# Altium schematic sheet Sheet1.SchDoc
size A; SheetNumber: 1; SheetTotal: 1
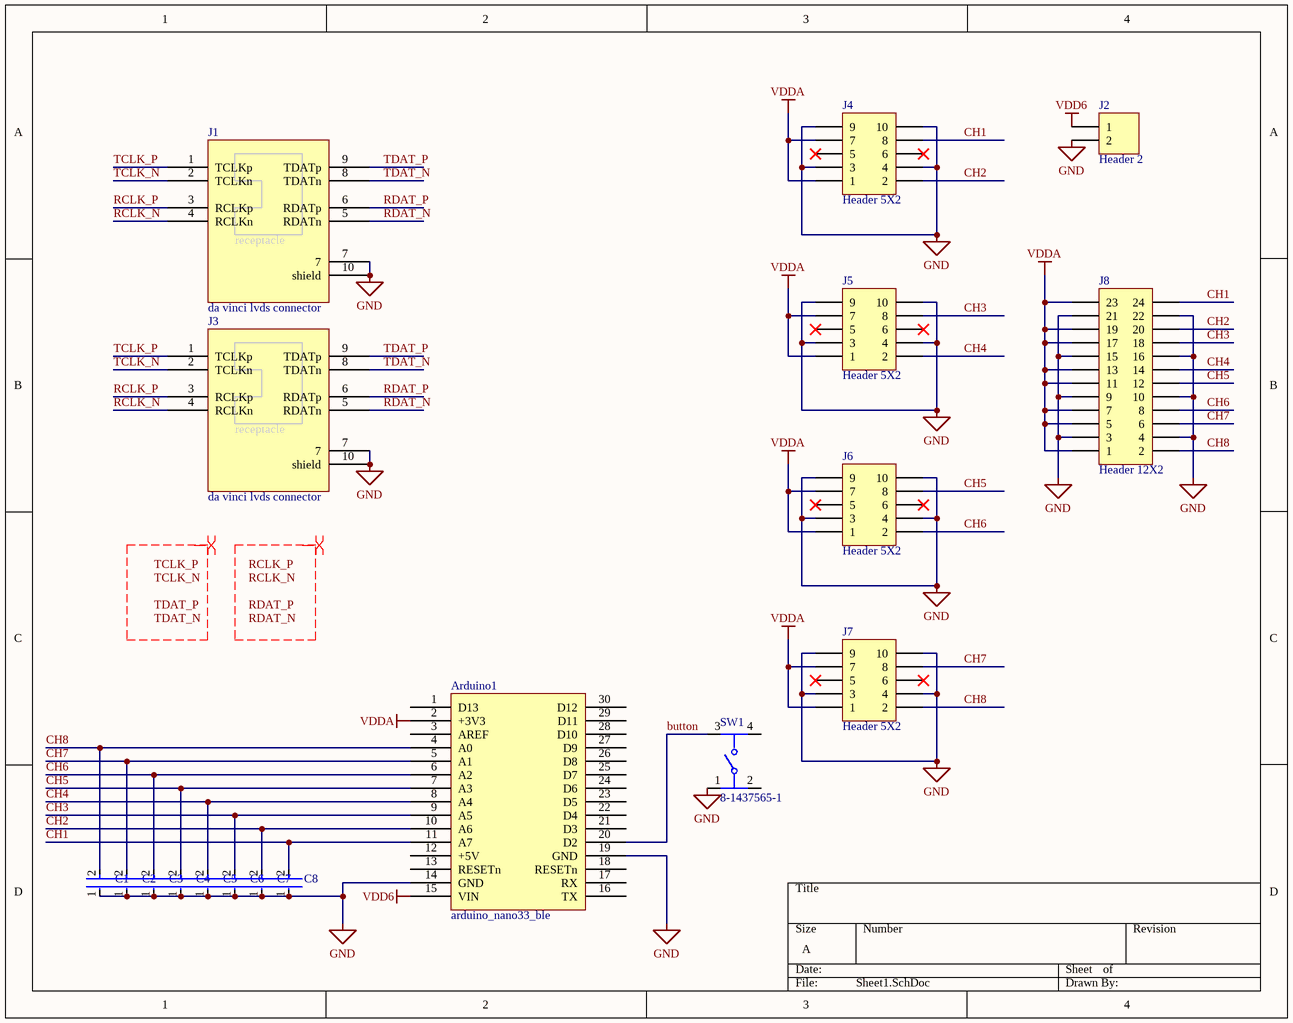
[diagram p0: Sheet1.SchDoc]

## Parts
Arduino1  arduino_nano33_ble  [arduino_nano33_ble]
C1  GRM155R71C104KA88D  [FP-GRM15-MFG]  (value not drawn)
C2  GRM155R71C104KA88D  [FP-GRM15-MFG]  (value not drawn)
C3  GRM155R71C104KA88D  [FP-GRM15-MFG]  (value not drawn)
C4  GRM155R71C104KA88D  [FP-GRM15-MFG]  (value not drawn)
C5  GRM155R71C104KA88D  [FP-GRM15-MFG]  (value not drawn)
C6  GRM155R71C104KA88D  [FP-GRM15-MFG]  (value not drawn)
C7  GRM155R71C104KA88D  [FP-GRM15-MFG]  (value not drawn)
C8  GRM155R71C104KA88D  [FP-GRM15-MFG]  (value not drawn)
J1  da vinci lvds connector  [1394b]
J2  Header 2  [jst_2mm]
J3  da vinci lvds connector  [1394b]
J4  Header 5X2  [jst_pad10]
J5  Header 5X2  [jst_pad10]
J6  Header 5X2  [jst_pad10]
J7  Header 5X2  [jst_pad10]
J8  Header 12X2  [jst_pad24]
SW1  8-1437565-1  [FP-8-1437565-1-MFG]

## Nets
GND: Arduino1.14(GND) Arduino1.19(GND) C1.1 C2.1 C3.1 C4.1 C5.1 C6.1 C7.1 C8.1 J1.7 J1.10(shield) J2.2 J3.7 J3.10(shield) J4.3 J4.4 J4.9 J4.10 J5.3 J5.4 J5.9 J5.10 J6.3 J6.4 J6.9 J6.10 J7.3 J7.4 J7.9 J7.10 J8.3 J8.4 J8.9 J8.10 J8.15 J8.16 J8.21 J8.22 SW1.1
VDD6: Arduino1.15(VIN) J2.1
VDDA: Arduino1.2(+3V3) J4.1 J4.7 J5.1 J5.7 J6.1 J6.7 J7.1 J7.7 J8.1 J8.5 J8.7 J8.11 J8.13 J8.17 J8.19 J8.23
button: Arduino1.20(D2) SW1.3
CH1: Arduino1.11(A7) C8.2 J4.8 J8.24
CH2: Arduino1.10(A6) C7.2 J4.2 J8.20
CH3: Arduino1.9(A5) C6.2 J5.8 J8.18
CH4: Arduino1.8(A4) C5.2 J5.2 J8.14
CH5: Arduino1.7(A3) C4.2 J6.8 J8.12
CH6: Arduino1.6(A2) C3.2 J6.2 J8.8
CH7: Arduino1.5(A1) C2.2 J7.8 J8.6
CH8: Arduino1.4(A0) C1.2 J7.2 J8.2
RCLK_N: J1.4(RCLKn) J3.4(RCLKn)
RCLK_P: J1.3(RCLKp) J3.3(RCLKp)
RDAT_N: J1.5(RDATn) J3.5(RDATn)
RDAT_P: J1.6(RDATp) J3.6(RDATp)
TCLK_N: J1.2(TCLKn) J3.2(TCLKn)
TCLK_P: J1.1(TCLKp) J3.1(TCLKp)
TDAT_N: J1.8(TDATn) J3.8(TDATn)
TDAT_P: J1.9(TDATp) J3.9(TDATp)

Not connected (* = marked no-connect by the designer): Arduino1 1(D13) 3(AREF) 12(+5V) 13(RESETn) 16(TX) 17(RX) 18(RESETn) 21(D3) 22(D4) 23(D5) 24(D6) 25(D7) 26(D8) 27(D9) 28(D10) 29(D11) 30(D12); J4 5* 6*; J5 5* 6*; J6 5* 6*; J7 5* 6*; SW1 2 4

## Layout directives
differential pair: RCLK_N, RCLK_P, RDAT_N, RDAT_P, TCLK_N, TCLK_P, TDAT_N, TDAT_P

## Notes on the sheet
- Labels drawn without touching a wire or pin: RCLK_N, RCLK_P, RDAT_N, RDAT_P, TCLK_N, TCLK_P, TDAT_N, TDAT_P
- (in symbol davinci_lvds) receptacle

## Library data of the parts
C1-C8 = CMP-2100-03641-2: CAP CER 0.1UF 16V X7R 0402; Manufacturer: Murata; Standoff Height: 0mm; Tolerance: 10%; Description: CAP Ceramic 0.10μF 10% X7R 16Vdc 0402 SMD; Voltage Rating: 16Vdc; Material: Ceramic; Capacitance: 0.10μF; Value: 0.10μF; RoHS: TRUE; Manufacturer Part Number: GRM155R71C104KA88D; Temperature Characteristic: X7R; Octopart: https://octopart.com/grm155r71c104ka88d-murata-196880; Digikey Description: CAP CER 0.1UF 16V X7R 0402; Device Class L3: Ceramic Capacitors; Height: 0.55mm; ComponentLink2Description: Datasheet; Temperature Range Low: -55°C; Ipc Land Pattern Name: CAPC10050X219; ComponentLink2URL: https://search.murata.co.jp/Ceramy/image/img/A01X/G101/ENG/GRM155R71H471KA01-01A.pdf; Device Class L1: Passive Components; Lead Free: yes; Category: Cap; Package: GRM15; Temperature: -55°C to +125°C; Device Class L2: Capacitors; Temperature Range High: +125°C; Mouser Description: 0402 0.1 uF 16V ±10 % Tolerance X7R SMT Multilayer Ceramic Capacitor
J1 J3 = davinci_lvds
J2 = Header 2: Header, 2-Pin; LatestRevisionDate: 17-Jul-2002; LatestRevisionNote: Re-released for DXP Platform.; Publisher: Altium Limited
J4-J7 = Header 5X2: Header, 5-Pin, Dual row; LatestRevisionDate: 17-Jul-2002; LatestRevisionNote: Re-released for DXP Platform.; Publisher: Altium Limited
J8 = Header 12X2: Header, 12-Pin, Dual row; LatestRevisionDate: 17-Jul-2002; LatestRevisionNote: Re-released for DXP Platform.; Publisher: Altium Limited
SW1 = CMP-03407-000016-1: SWITCH TACTILE SPST-NO 0.02A 15V; Actuator Length: 0.4mm; Actuator Material: Brass; Contact Current Rating: 20mA; Switch Travel: 0.25mm; Switch Function: Off-Mom; Electrical Life: 500000Cycles; Contact Resistance: 100mR; Illumination Type: Non-Illuminated; Operating Force: 1.57N; Actuator Type: Standard; Throw Configuration: SPST; Radiation Hardening: No; Orientation: Straight; Packaging: Tape and Reel; Type: Switch; Max Operating Temperature: 85°C; Contact Material: Copper Alloy; Package Quantity: 4000; Max Voltage Rating (DC): 15V; Contact Plating: Silver; Mechanical Life: 500000Cycles; Case/Package: SMD/SMT; RoHS Compliant: Yes; Series: FSMCT; Mount: Surface Mount; Max Current Rating: 20mA; ELV: Compliant; Voltage Rating (DC): 15V; Termination: Gull Wing; Min Operating Temperature: -35°C